# EAGLE design URC-PASSTHROUGH (EAGLE 9.6.2)
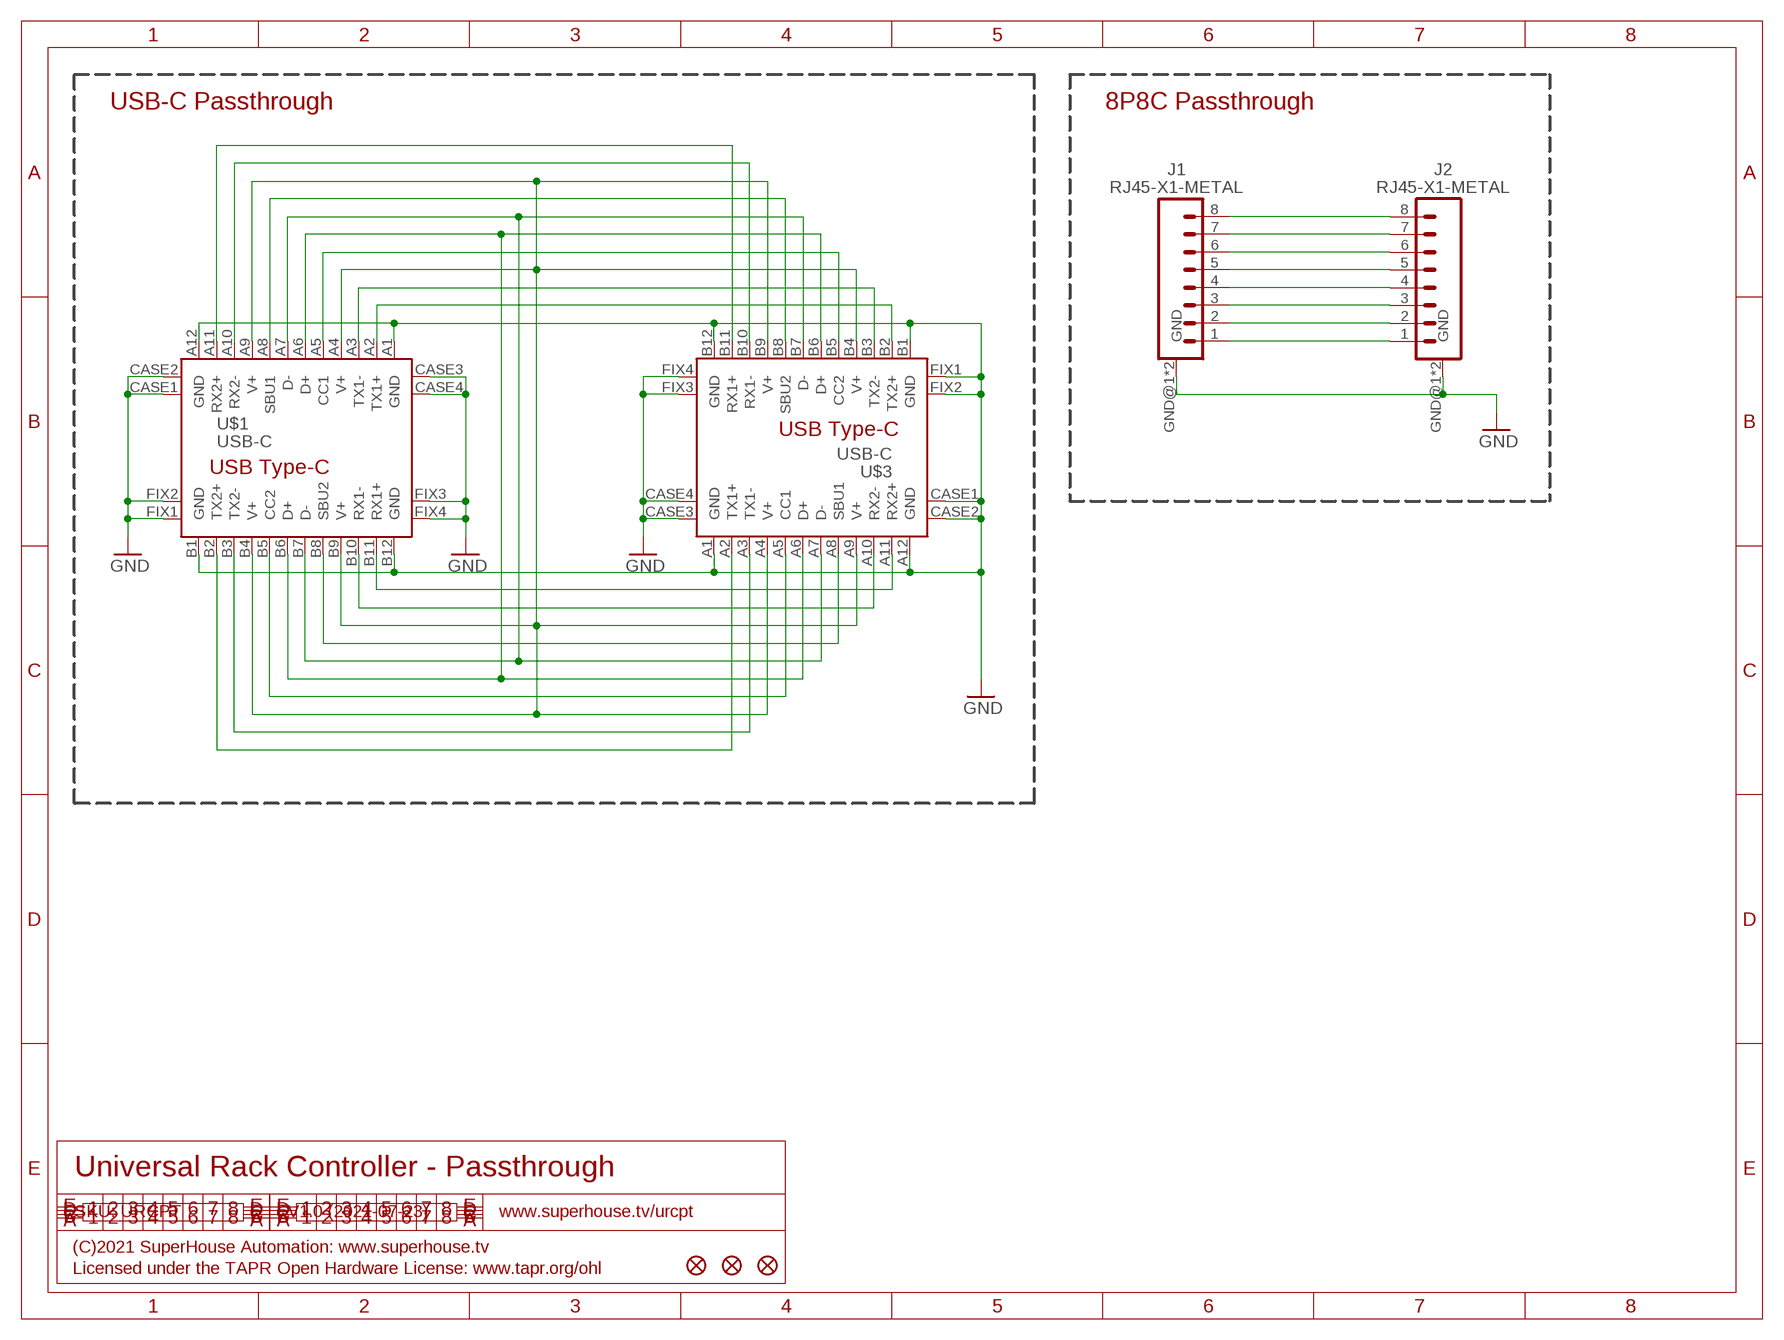
[diagram p0: schematic, sheet 1]

## Parts
FID1  FIDUCIAL1X2.5  [FIDUCIAL-1X2.5]
FID2  FIDUCIAL1X2.5  [FIDUCIAL-1X2.5]
FID3  FIDUCIAL1X2.5  [FIDUCIAL-1X2.5]
J1  RJ45-X1-METAL  [RJ45-1X1]
J2  RJ45-X1-METAL  [RJ45-1X1]
U$1  USB-C  [USB-C-U52A]
U$3  USB-C  [USB-C-U52A]

## Nets
GND: J1.GND@1(GND) J1.GND@2(GND) J2.GND@1(GND) J2.GND@2(GND) U$1.A1(GND) U$1.A12(GND) U$1.B1(GND) U$1.B12(GND) U$1.CASE1(GND) U$1.CASE2(GND) U$1.CASE3(GND) U$1.CASE4(GND) U$1.FIX1(GND) U$1.FIX2(GND) U$1.FIX3(GND) U$1.FIX4(GND) U$3.A1(GND) U$3.A12(GND) U$3.B1(GND) U$3.B12(GND) U$3.CASE1(GND) U$3.CASE2(GND) U$3.CASE3(GND) U$3.CASE4(GND) U$3.FIX1(GND) U$3.FIX2(GND) U$3.FIX3(GND) U$3.FIX4(GND)
N$1: J1.1 J2.1
N$2: J1.2 J2.2
N$3: J1.3 J2.3
N$4: J1.4 J2.4
N$5: J1.5 J2.5
N$6: J1.6 J2.6
N$7: J1.7 J2.7
N$8: J1.8 J2.8
N$10: U$1.A2(TX1+) U$3.B2(TX2+)
N$11: U$1.A3(TX1-) U$3.B3(TX2-)
N$12: U$1.A8(SBU1) U$3.B8(SBU2)
N$13: U$1.A5(CC1) U$3.B5(CC2)
N$14: U$1.A6(D+) U$1.B6(D+) U$3.A6(D+) U$3.B6(D+)
N$15: U$1.A7(D-) U$1.B7(D-) U$3.A7(D-) U$3.B7(D-)
N$18: U$1.A10(RX2-) U$3.B10(RX1-)
N$19: U$1.A11(RX2+) U$3.B11(RX1+)
N$22: U$1.B11(RX1+) U$3.A11(RX2+)
N$23: U$1.B10(RX1-) U$3.A10(RX2-)
N$24: U$1.A4(V+) U$1.A9(V+) U$1.B4(V+) U$1.B9(V+) U$3.A4(V+) U$3.A9(V+) U$3.B4(V+) U$3.B9(V+)
N$25: U$1.B8(SBU2) U$3.A8(SBU1)
N$28: U$1.B5(CC2) U$3.A5(CC1)
N$30: U$1.B3(TX2-) U$3.A3(TX1-)
N$31: U$1.B2(TX2+) U$3.A2(TX1+)

## Notes on the sheet
- USB-C Passthrough | 8P8C Passthrough
- Universal Rack Controller - Passthrough
- SKU: URCPT | V1.0 (2021-07-23) | www.superhouse.tv/urcpt
- (C)2021 SuperHouse Automation: www.superhouse.tv
- Licensed under the TAPR Open Hardware License: www.tapr.org/ohl

## Library data of the parts
FID1-FID3 = SuperHouse-Symbols:FIDUCIAL: Fiducial Alignment Points Various fiducial points for machine vision alignment.
J1 J2 = SuperHouse-Connectors:RJ45-X1: RJ45 socket with GND connection
U$1 U$3 = SuperHouse-Connectors:USB-C

## Board
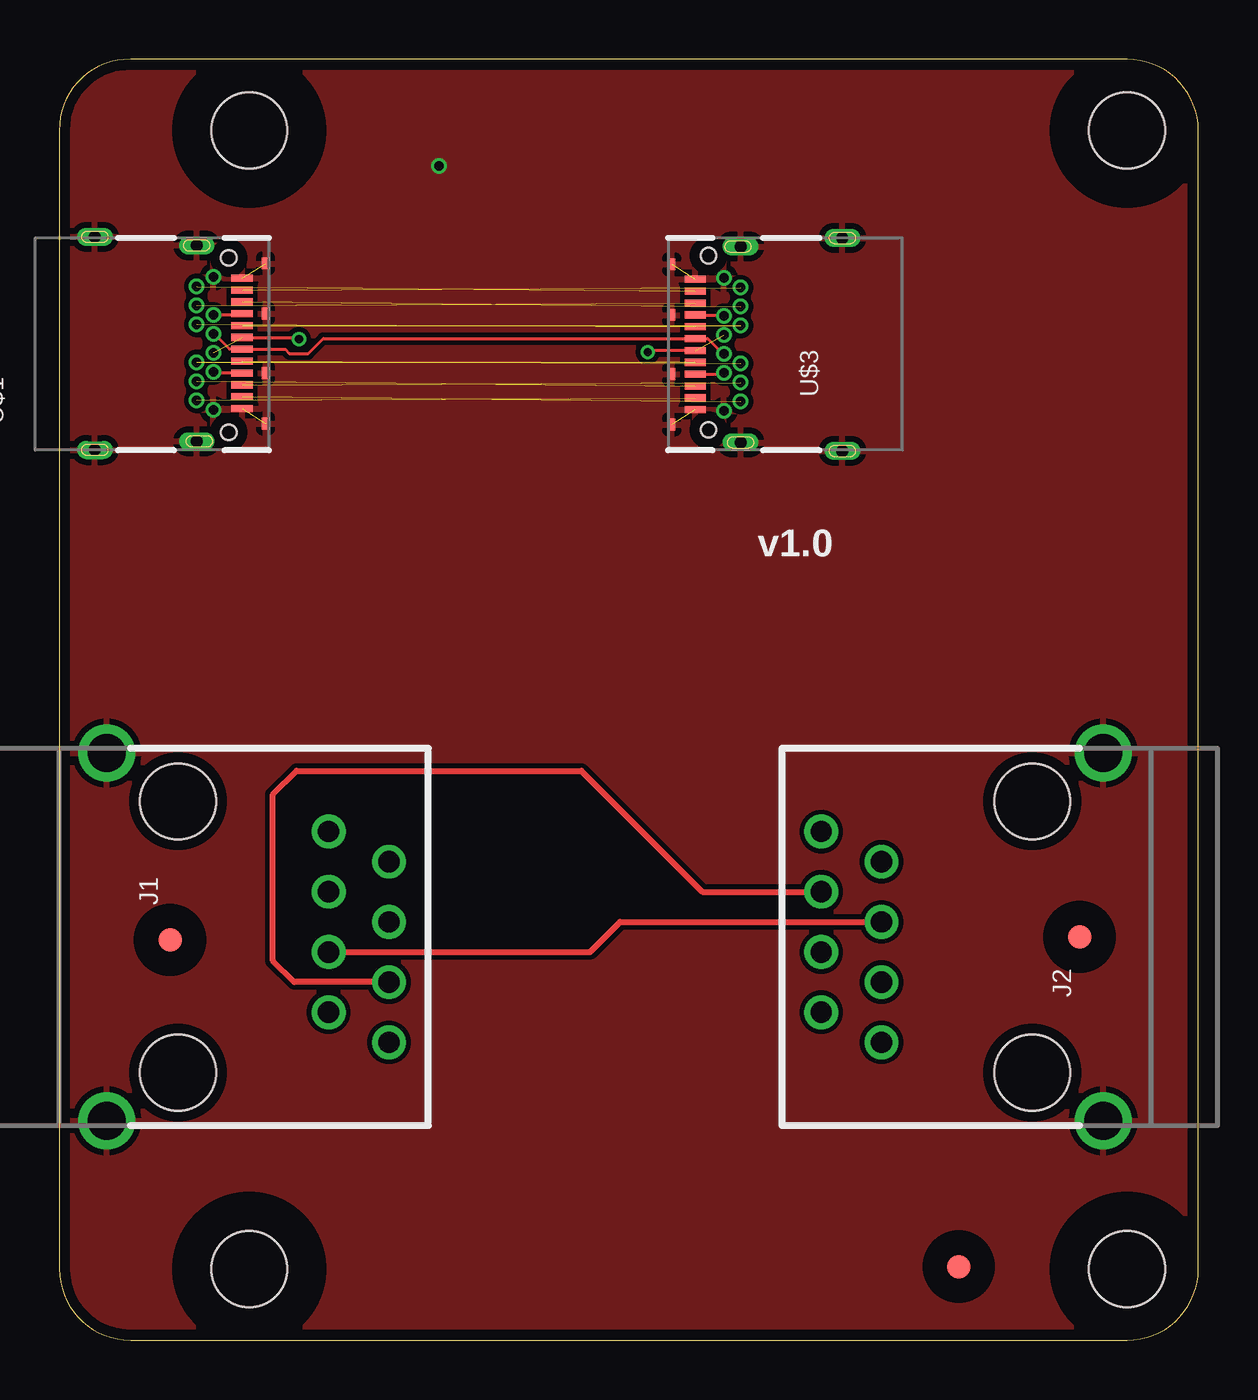
[diagram p1: board, top side]
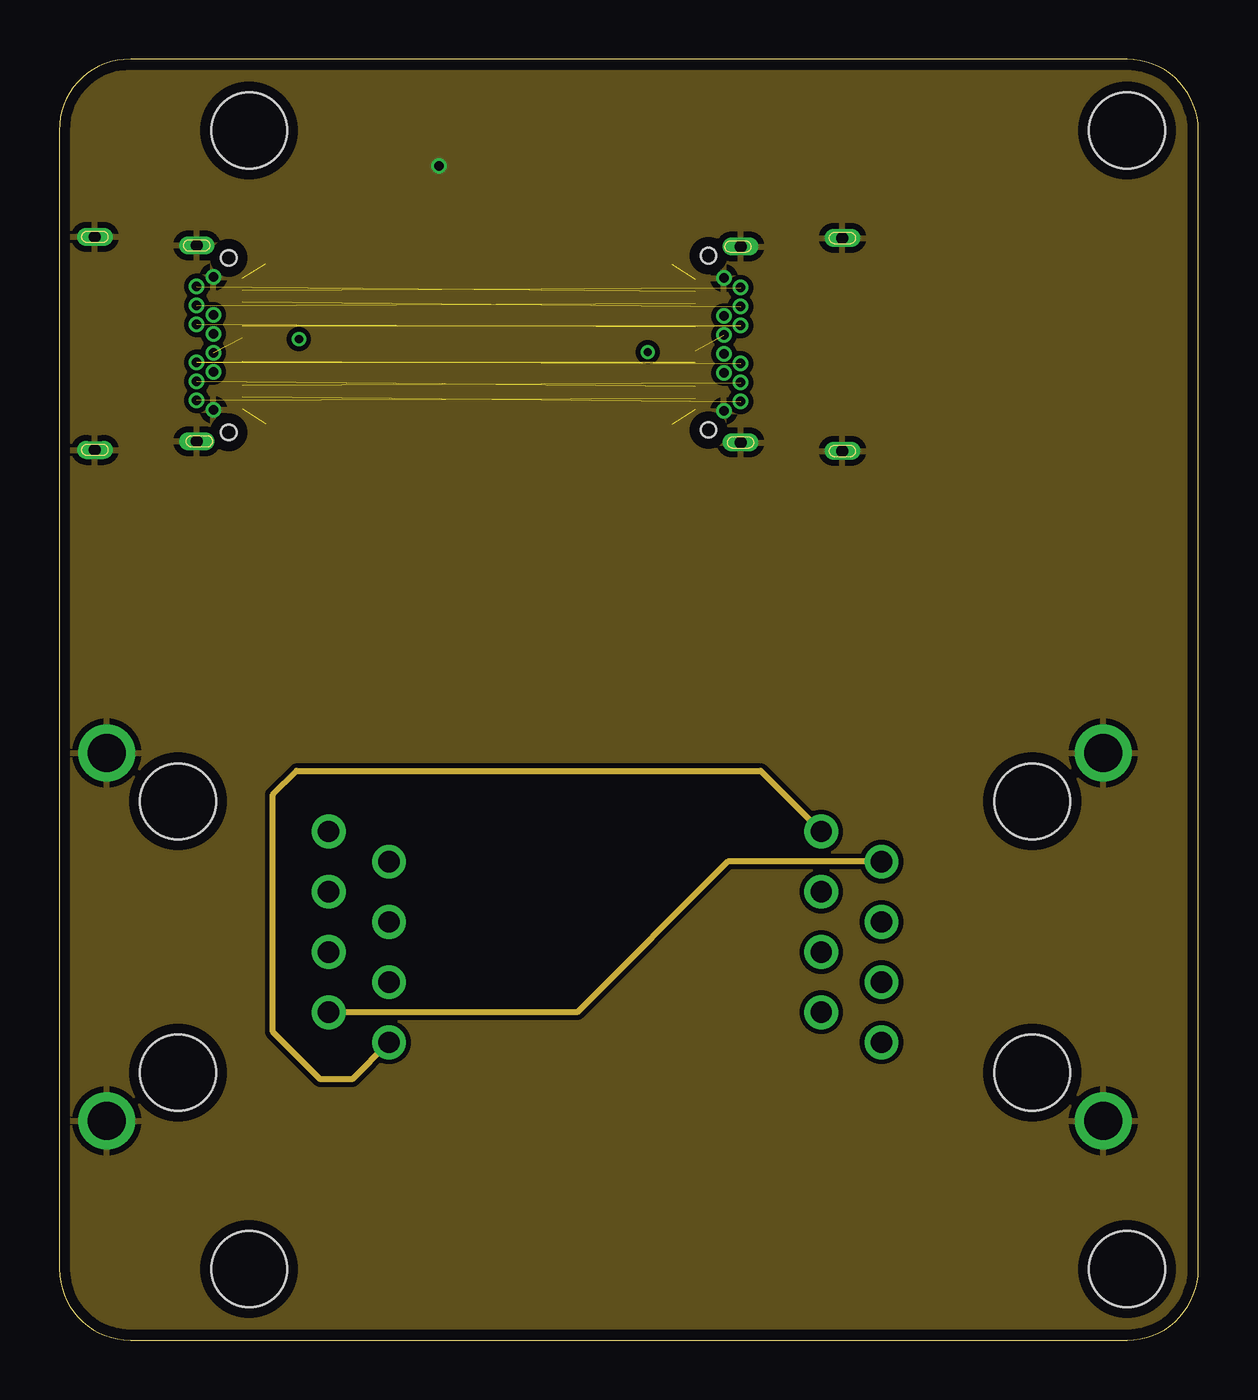
[diagram p2: board, inner layer Route2]
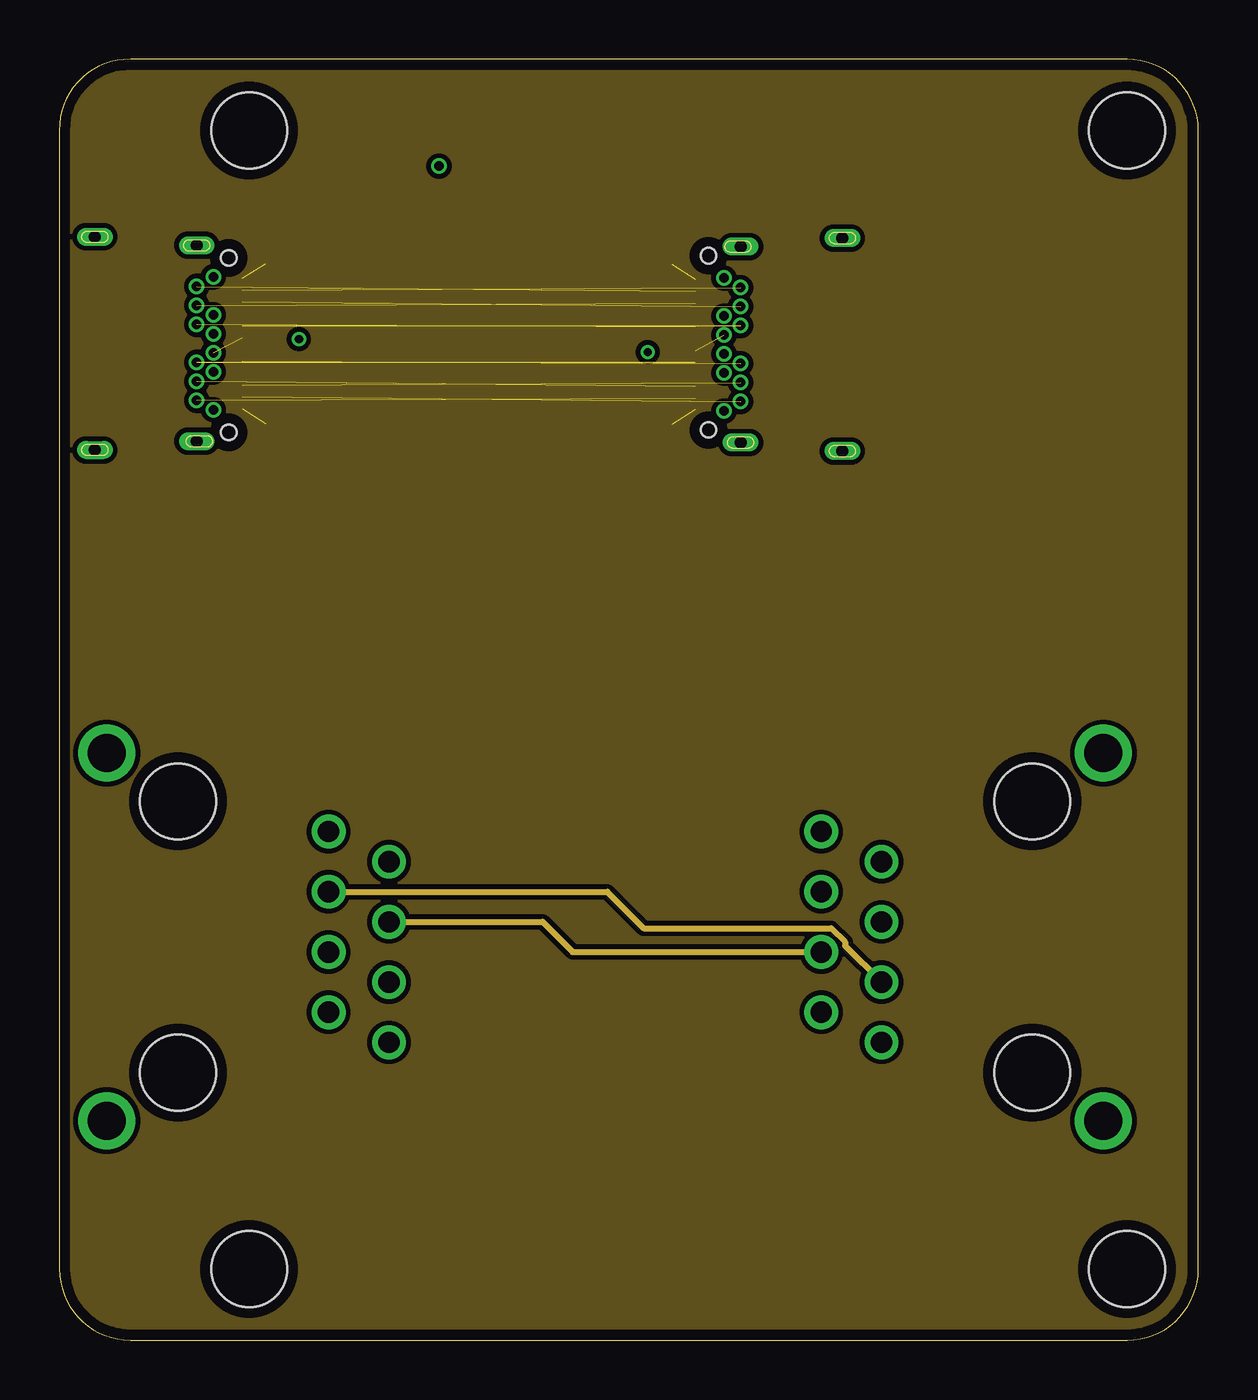
[diagram p3: board, inner layer Route15]
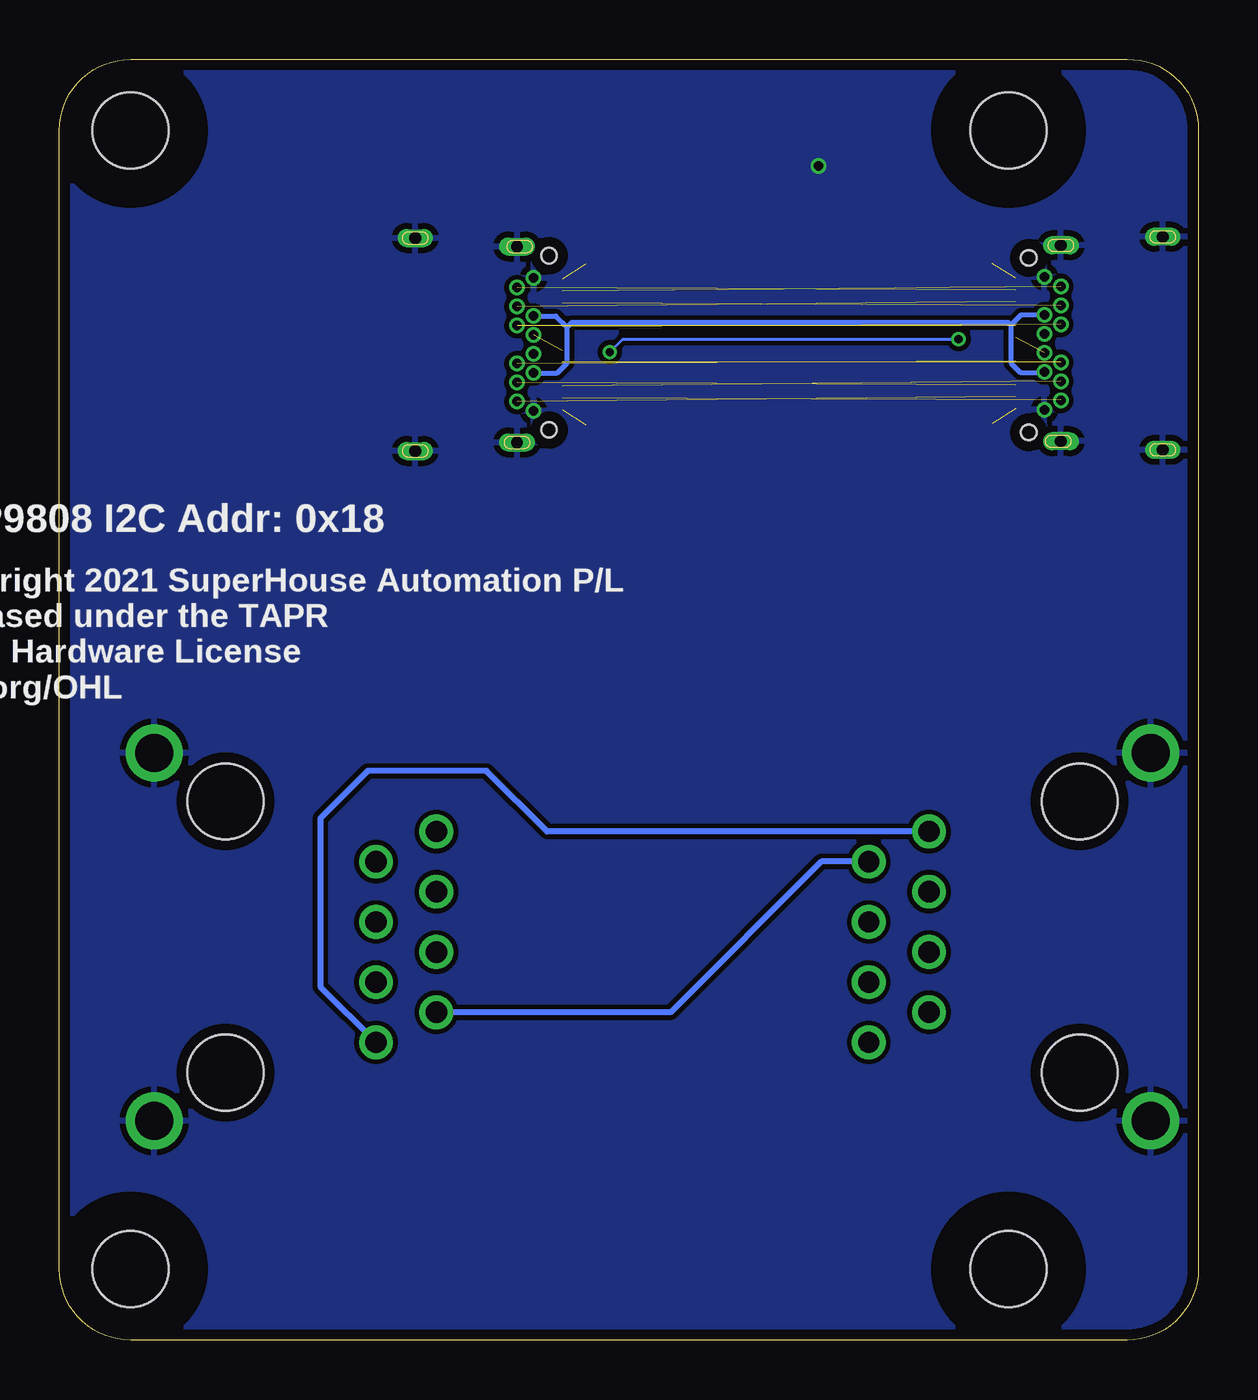
[diagram p4: board, bottom side, seen from below]

Size 48 x 54 mm. Coordinates in mm from the lower left corner, seen from the top.
Outline: 0,3 arc90 3,0 45,0 arc90 48,3 48,51 arc90 45,54 3,54 arc92 0,51 0,3
Copper layers (1+2*15+16): Top 0.035mm / dielectric 1.5mm / Route2 0.035mm / dielectric 0.15mm / Route15 0.035mm / dielectric 0.2mm / Bottom 0.035mm
Design rules "SuperHouse-Design-Rules *": minimum track width 5mil, minimum drill 0.35mm, track to track 8mil, track to pad 8mil, pad to pad 8mil, via to via 8mil, smd to smd 6mil, copper to edge 18mil, drill to drill 8mil, minimum pad ring 5mil, minimum via ring 5mil, stop-mask expansion 4mil, vias tented up to drill 0.5mm, thermal gap 10mil
Holes 3.2 mm at 8,3 8,51 45,51 45,3
tRestrict: area 36.9,2.1 to 38.9,4.1; area 42,16 to 44,18; area 3.7,15.9 to 5.7,17.9; area 41.8,-0.2 to 48.2,6.2; area 4.8,-0.2 to 11.2,6.2; area 4.8,47.8 to 11.2,54.2; area 41.8,47.8 to 48.2,54.2
bRestrict: area 41.8,-0.2 to 48.2,6.2; area 41.8,47.8 to 48.2,54.2; area 4.8,-0.2 to 11.2,6.2; area 4.8,47.8 to 11.2,54.2

### Footprints (pad centres in the part's own frame; a part is rotated, then mirrored left to right if it is on the bottom)
FIDUCIAL-1X2.5 = smd 1 x 1: 1 0,0
RJ45-1X1 = drill 0.9 pad 1.422: 1 -4.445,6.35; 2 -3.175,8.89; 3 -1.905,6.35; 4 -0.635,8.89; 5 0.635,6.35; 6 1.905,8.89; 7 3.175,6.35; 8 4.445,8.89 | drill 1.6: GND@1 -7.75,-3; GND@2 7.75,-3 | hole 3.2: -5.715,0; 5.715,0
USB-C-U52A = smd 0.3 x 0.9: A1 -2.775,6.2; A2 -2.275,6.2; A3 -1.775,6.2; A4 -1.275,6.2; A5 -0.775,6.2; A6 -0.275,6.2; A7 0.225,6.2; A8 0.725,6.2; A9 1.225,6.2; A10 1.725,6.2; A11 2.225,6.2; A12 2.725,6.2 | drill 0.4 pad 0.6: B1 2.775,4.99; B2 2.375,4.29; B3 1.575,4.29; B4 1.175,4.99; B5 0.775,4.29; B6 0.375,4.99; B7 -0.425,4.99; B8 -0.825,4.29; B9 -1.225,4.99; B10 -1.625,4.29; B11 -2.425,4.29; B12 -2.825,4.99 | smd 0.5 x 0.3: CASE1 -3.395,7.19; CASE2 -1.275,7.19; CASE3 1.225,7.19; CASE4 3.355,7.19 | drill 0.5 pad 0.7 long: FIX1 -4.515,0; FIX2 -4.155,4.29; FIX3 4.105,4.29; FIX4 4.465,0 | hole 0.65: 3.725,5.64; -3.625,5.64

### Placement (x,y rotation side)
FID1  37.9,3.1 0 top
FID2  43,17 0 top
FID3  4.67,16.88 0 top
J1  5,17 270 top
J2  41,17 90 top
U$1  1.5,42 270 top
U$3  33,42 90 top

### Tracks (layer width: path | path; a pad name or v marks a point on that pad's centre or on a via)
3.3V
  pour Route15: 3,54 arc90 0,51 0,3 arc90 3,0 45,0 arc90 48,3 48,51 arc90 45,54
GND  (via drill 0.4)  (4 unrouted)
  other vias: 16,49.5
  pour Bottom: 0,51 arc-90 3,54 45,54 arc-90 48,51 48,3 arc-90 45,0 3,0 arc-90 0,3
  pour Route2: 3,54 arc90 0,51 0,3 arc90 3,0 45,0 arc90 48,3 48,51 arc90 45,54
  pour Top: 0,51 arc-90 3,54 45,54 arc-90 48,51 48,3 arc-90 45,0 3,0 arc-90 0,3
N$1
  Bottom 0.254: J1.1 27.45,21.45 30,24 35,24 37,22 37,14.9 J2.1
N$2
  Bottom 0.254: J1.2 15.89,20.18 22.24,13.82 J2.2
N$3
  Route15 0.254: J1.3 23.09,18.91 24.63,17.37 32.53,17.37 33.12,16.78 33.12,16.63 J2.3
N$4
  Route15 0.254: J1.4 20.36,17.64 21.64,16.36 J2.4
N$5
  Top 0.254: J1.5 22.36,16.36 23.64,17.64 J2.5
N$6
  Top 0.254: J1.6 9.9,15.1 9,16 9,23 10,24 22,24 27.09,18.91 J2.6
N$7
  Route2 0.254: J1.7 21.82,13.82 28.18,20.18 J2.7
N$8
  Route2 0.254: J2.8 29.55,24 10,24 9,23 9,13 11,11 12.34,11 J1.8
N$10  (1 unrouted)
N$11  (1 unrouted)
N$12  (1 unrouted)
N$13  (1 unrouted)
N$14  (via drill 0.35)  (2 unrouted)
  Top 0.127: U$1.A6 10.03,42.27 v10.1,42.2 | U$3.A6 24.87,41.73 v24.8,41.66
  Bottom 0.127: v24.8,41.66 24.26,42.2 v10.1,42.2
N$15
  Top 0.127: U$1.B7 6.7,42.22 6.74,42.22 7.18,41.77 U$1.A7 9.53,41.77 9.7,41.6 10.5,41.6 11.12,42.23 U$3.A7 27.32,42.23 27.76,41.78 27.8,41.78 U$3.B7
N$18  (1 unrouted)
N$19  (1 unrouted)
N$22  (1 unrouted)
N$23  (1 unrouted)
N$24
  Top 0.127: U$1.A4 7.65,43.23 U$1.B9 | U$3.A9 27.96,43.23 U$3.B4 | U$1.A9 6.54,40.77 U$1.B4 | U$3.A4 27.96,40.73 U$3.B9
  Bottom 0.203: U$1.B9 7.47,43.23 7.9,42.8 | U$1.B4 6.51,40.8 7.5,40.8 7.9,41.2 7.9,42.8 | U$3.B4 27.07,43.17 26.6,42.7 | U$3.B9 27.02,40.77 26.6,41.2 26.6,42.7 | 7.9,42.8 8,42.9 26.4,42.9 26.6,42.7
N$25  (1 unrouted)
N$28  (1 unrouted)
N$30  (1 unrouted)
N$31  (1 unrouted)

### Text on the board
tPlace: v1.0 | Universal / Rack Controller | Passthrough Edition | www.superhouse.tv/urc | Super / House
bPlace: MCP9808 I2C Addr: 0x18 | Copyright 2021 SuperHouse Automation P/L / Released under the TAPR / Open Hardware License / tapr.org/OHL